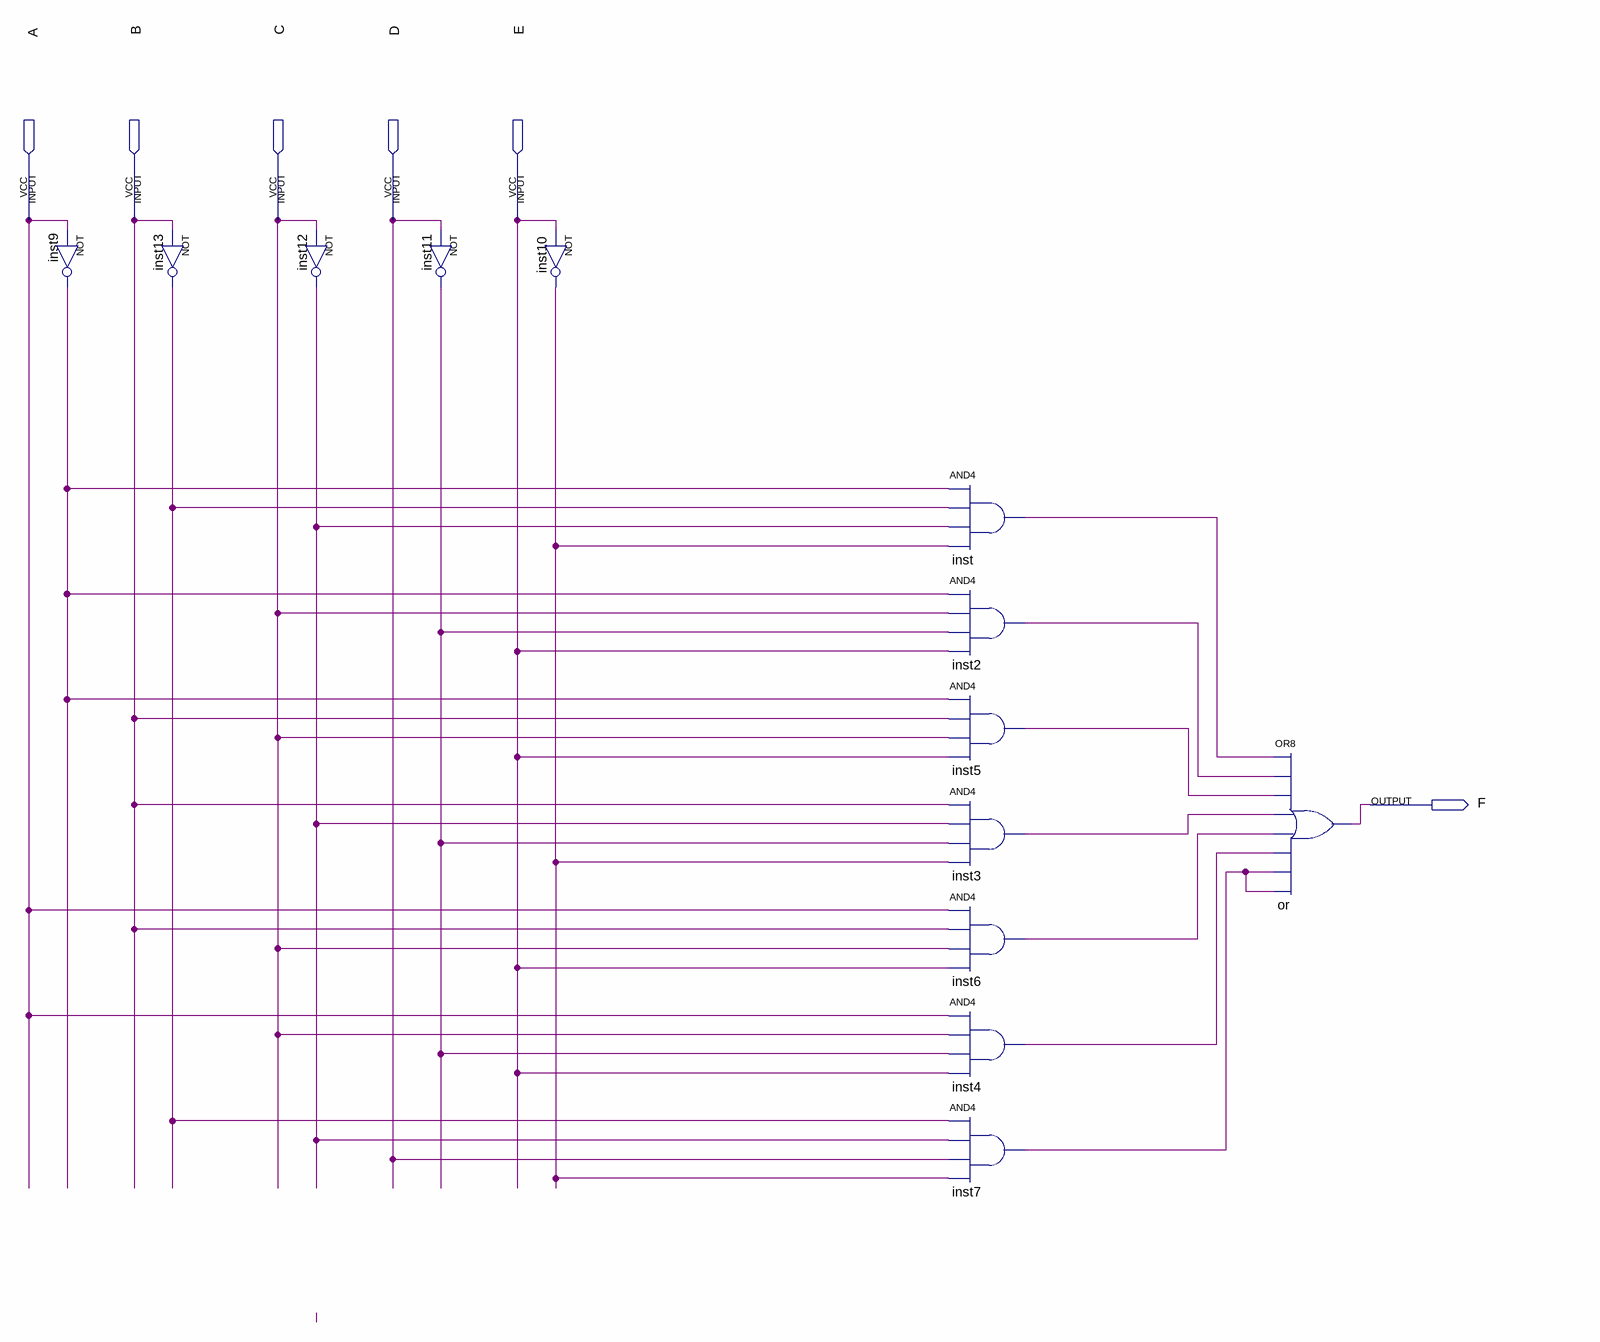
[diagram p0: schematic sheet]
// Quartus schematic tarefa2.bdf as structural Verilog: 13 symbols, 6 pins
module tarefa2 (
  input  A,
  input  B,
  input  C,
  input  D,
  input  E,
  output F
);

  wire inst2_out, inst3_out, inst4_out, inst5_out, inst6_out, inst7_out, inst9_out, inst10_out, inst11_out,
       inst12_out, inst13_out, inst_out;

  not inst9 (inst9_out, A);
  not inst13 (inst13_out, B);
  not inst12 (inst12_out, C);
  not inst11 (inst11_out, D);
  not inst10 (inst10_out, E);
  and inst (inst_out, inst9_out, inst13_out, inst12_out, inst10_out);
  and inst2 (inst2_out, inst9_out, C, inst11_out, E);
  and inst5 (inst5_out, inst9_out, B, C, E);
  and inst3 (inst3_out, B, inst12_out, inst11_out, inst10_out);
  and inst6 (inst6_out, A, B, C, E);
  and inst4 (inst4_out, A, C, inst11_out, E);
  and inst7 (inst7_out, inst13_out, inst12_out, D, inst10_out);
  or \or  (F, inst_out, inst2_out, inst5_out, inst3_out, inst6_out, inst4_out, inst7_out, inst7_out);
endmodule
